# Altium schematic sheet Bank3-4-5_I_O.SchDoc
size A3
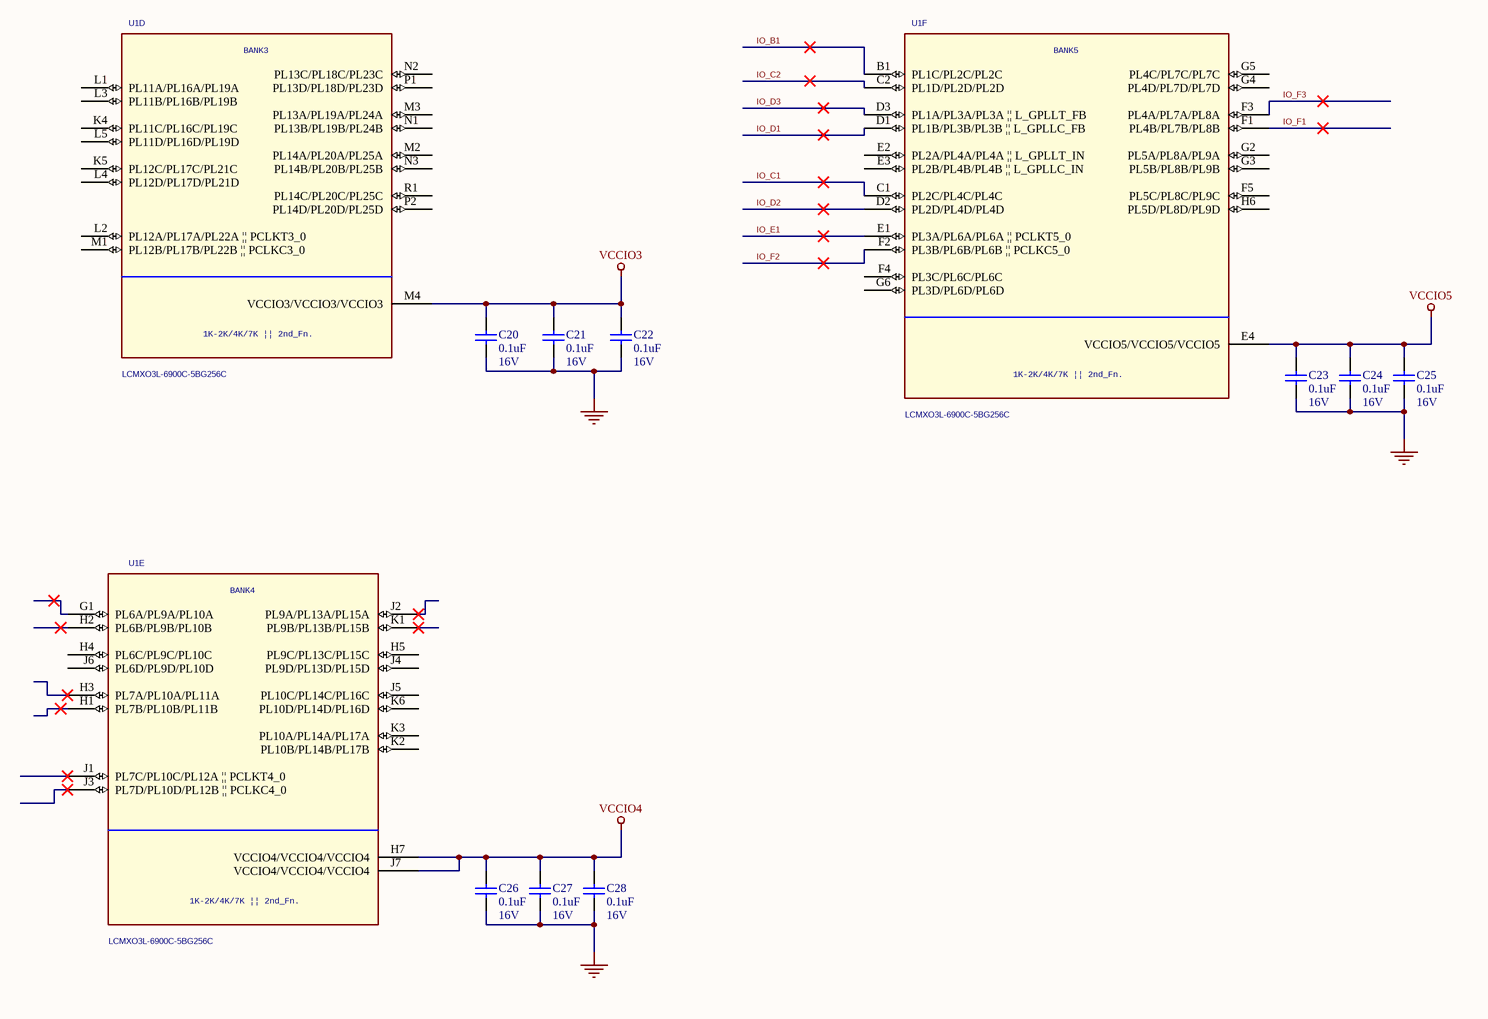
[diagram p0: Bank3-4-5_I_O.SchDoc]

## Parts
C20  value 0.1uF  Voltage: 16V  [CAPC1608X87X35ML15T15]  (hidden comment: C0603C104M4RACTU)
C21  value 0.1uF  Voltage: 16V  [CAPC1608X87X35ML15T15]  (hidden comment: C0603C104M4RACTU)
C22  value 0.1uF  Voltage: 16V  [CAPC1608X87X35ML15T15]  (hidden comment: C0603C104M4RACTU)
C23  value 0.1uF  Voltage: 16V  [CAPC1608X87X35ML15T15]  (hidden comment: C0603C104M4RACTU)
C24  value 0.1uF  Voltage: 16V  [CAPC1608X87X35ML15T15]  (hidden comment: C0603C104M4RACTU)
C25  value 0.1uF  Voltage: 16V  [CAPC1608X87X35ML15T15]  (hidden comment: C0603C104M4RACTU)
C26  value 0.1uF  Voltage: 16V  [CAPC1608X87X35ML15T15]  (hidden comment: C0603C104M4RACTU)
C27  value 0.1uF  Voltage: 16V  [CAPC1608X87X35ML15T15]  (hidden comment: C0603C104M4RACTU)
C28  value 0.1uF  Voltage: 16V  [CAPC1608X87X35ML15T15]  (hidden comment: C0603C104M4RACTU)
U1  LCMXO3L-6900C-5BG256C  [BGA256C80P16X16_1400X1400X170]  (parts D,E,F of 7)

## Nets
GND: C20.2 C21.2 C22.2 C23.2 C24.2 C25.2 C26.2 C27.2 C28.2
VCCIO3: C20.1 C21.1 C22.1 U1.M4(VCCIO3/VCCIO3/VCCIO3)
VCCIO4: C26.1 C27.1 C28.1 U1.H7(VCCIO4/VCCIO4/VCCIO4) U1.J7(VCCIO4/VCCIO4/VCCIO4)
VCCIO5: C23.1 C24.1 C25.1 U1.E4(VCCIO5/VCCIO5/VCCIO5)
IO_B1: U1.B1(PL1C/PL2C/PL2C)
IO_C1: U1.C1(PL2C/PL4C/PL4C)
IO_C2: U1.C2(PL1D/PL2D/PL2D)
IO_D1: U1.D1(PL1B/PL3B/PL3B_||_L_GPLLC_FB)
IO_D2: U1.D2(PL2D/PL4D/PL4D)
IO_D3: U1.D3(PL1A/PL3A/PL3A_||_L_GPLLT_FB)
IO_E1: U1.E1(PL3A/PL6A/PL6A_||_PCLKT5_0)
IO_F1: U1.F1(PL4B/PL7B/PL8B)
IO_F2: U1.F2(PL3B/PL6B/PL6B_||_PCLKC5_0)
IO_F3: U1.F3(PL4A/PL7A/PL8A)

Not connected (* = marked no-connect by the designer): U1 E2(PL2A/PL4A/PL4A_||_L_GPLLT_IN) E3(PL2B/PL4B/PL4B_||_L_GPLLC_IN) F4(PL3C/PL6C/PL6C) F5(PL5C/PL8C/PL9C) G1(PL6A/PL9A/PL10A)* G2(PL5A/PL8A/PL9A) G3(PL5B/PL8B/PL9B) G4(PL4D/PL7D/PL7D) G5(PL4C/PL7C/PL7C) G6(PL3D/PL6D/PL6D) H1(PL7B/PL10B/PL11B)* H2(PL6B/PL9B/PL10B)* H3(PL7A/PL10A/PL11A)* H4(PL6C/PL9C/PL10C) H5(PL9C/PL13C/PL15C) H6(PL5D/PL8D/PL9D) J1(PL7C/PL10C/PL12A_||_PCLKT4_0)* J2(PL9A/PL13A/PL15A)* J3(PL7D/PL10D/PL12B_||_PCLKC4_0)* J4(PL9D/PL13D/PL15D) J5(PL10C/PL14C/PL16C) J6(PL6D/PL9D/PL10D) K1(PL9B/PL13B/PL15B)* K2(PL10B/PL14B/PL17B) K3(PL10A/PL14A/PL17A) K4(PL11C/PL16C/PL19C) K5(PL12C/PL17C/PL21C) K6(PL10D/PL14D/PL16D) L1(PL11A/PL16A/PL19A) L2(PL12A/PL17A/PL22A_||_PCLKT3_0) L3(PL11B/PL16B/PL19B) L4(PL12D/PL17D/PL21D) L5(PL11D/PL16D/PL19D) M1(PL12B/PL17B/PL22B_||_PCLKC3_0) M2(PL14A/PL20A/PL25A) M3(PL13A/PL19A/PL24A) N1(PL13B/PL19B/PL24B) N2(PL13C/PL18C/PL23C) N3(PL14B/PL20B/PL25B) P1(PL13D/PL18D/PL23D) P2(PL14D/PL20D/PL25D) R1(PL14C/PL20C/PL25C)

## Notes on the sheet
- Title
- Size:
- Date:
- A3
- Number:
- Time:
- Revision:
- Sheet
- of
- File:
- (in symbol LCMXO3L-1K/2K/4K/7K-BG256, part D) BANK3; 1K-2K/4K/7K || 2nd_Fn.
- (in symbol LCMXO3L-1K/2K/4K/7K-BG256, part E) BANK4; 1K-2K/4K/7K || 2nd_Fn.
- (in symbol LCMXO3L-1K/2K/4K/7K-BG256, part F) BANK5; 1K-2K/4K/7K || 2nd_Fn.

## Library data of the parts
C20-C28 = CMP-2006-03067-1: Ceramic Capacitor 0.1uF 16V +-10% X7R0603; Manufacturer: Kemet; Alternative1: C1608X7R1E104K TDK; Alternative2: CC0603KRX7R8BB104 Yageo; Alternative3: GRM188R72A104KA35D Murata; Part Number: C0603C104M4RACTU; Package / Case: 0603
U1 = LCMXO3L-1K/2K/4K/7K-BG256: IC FPGA 6864LUTS 256BGA; Manufacturer: Lattice semi; Source Part: LCMXO3L-1K/2K/4K/7K-BG256A.Normal; SPLIT_INST: TRUE; SWAP_INFO: (S1+S2+S3+S4+S5+S6+S7); Name: I16790692; Primitive: DEFAULT; Implementation Type: <none>; Location X-Coordinate: 0; Source Library: D:\DESIGN_DOC\XO3\LATTICEORCADCAPTURESCHEMATICLIBRARYOLB\LATTICEORCADCAPTURESCHEMATICLIBRARYOLB\LATTICE_SYM\LATTICEPLDS.OLB; Power Pins Visible: False; Digikey P/N: 220-1886-ND; Location Y-Coordinate: 0; Color: Default; Source Package: LCMXO3L-1K/2K/4K/7K-BG256; Graphic: LCMXO3L-1K/2K/4K/7K-BG256A.Normal; Manufacturer Part Number: LCMXO3L-6900C-5BG256C